# Altium schematic sheet MCU.SchDoc
size A3; Organization: Altium Limited; Address1: L3, 12a Rodborough Rd; Address2: Frenchs Forest; Address3: NSW; Address4: Australia 2086
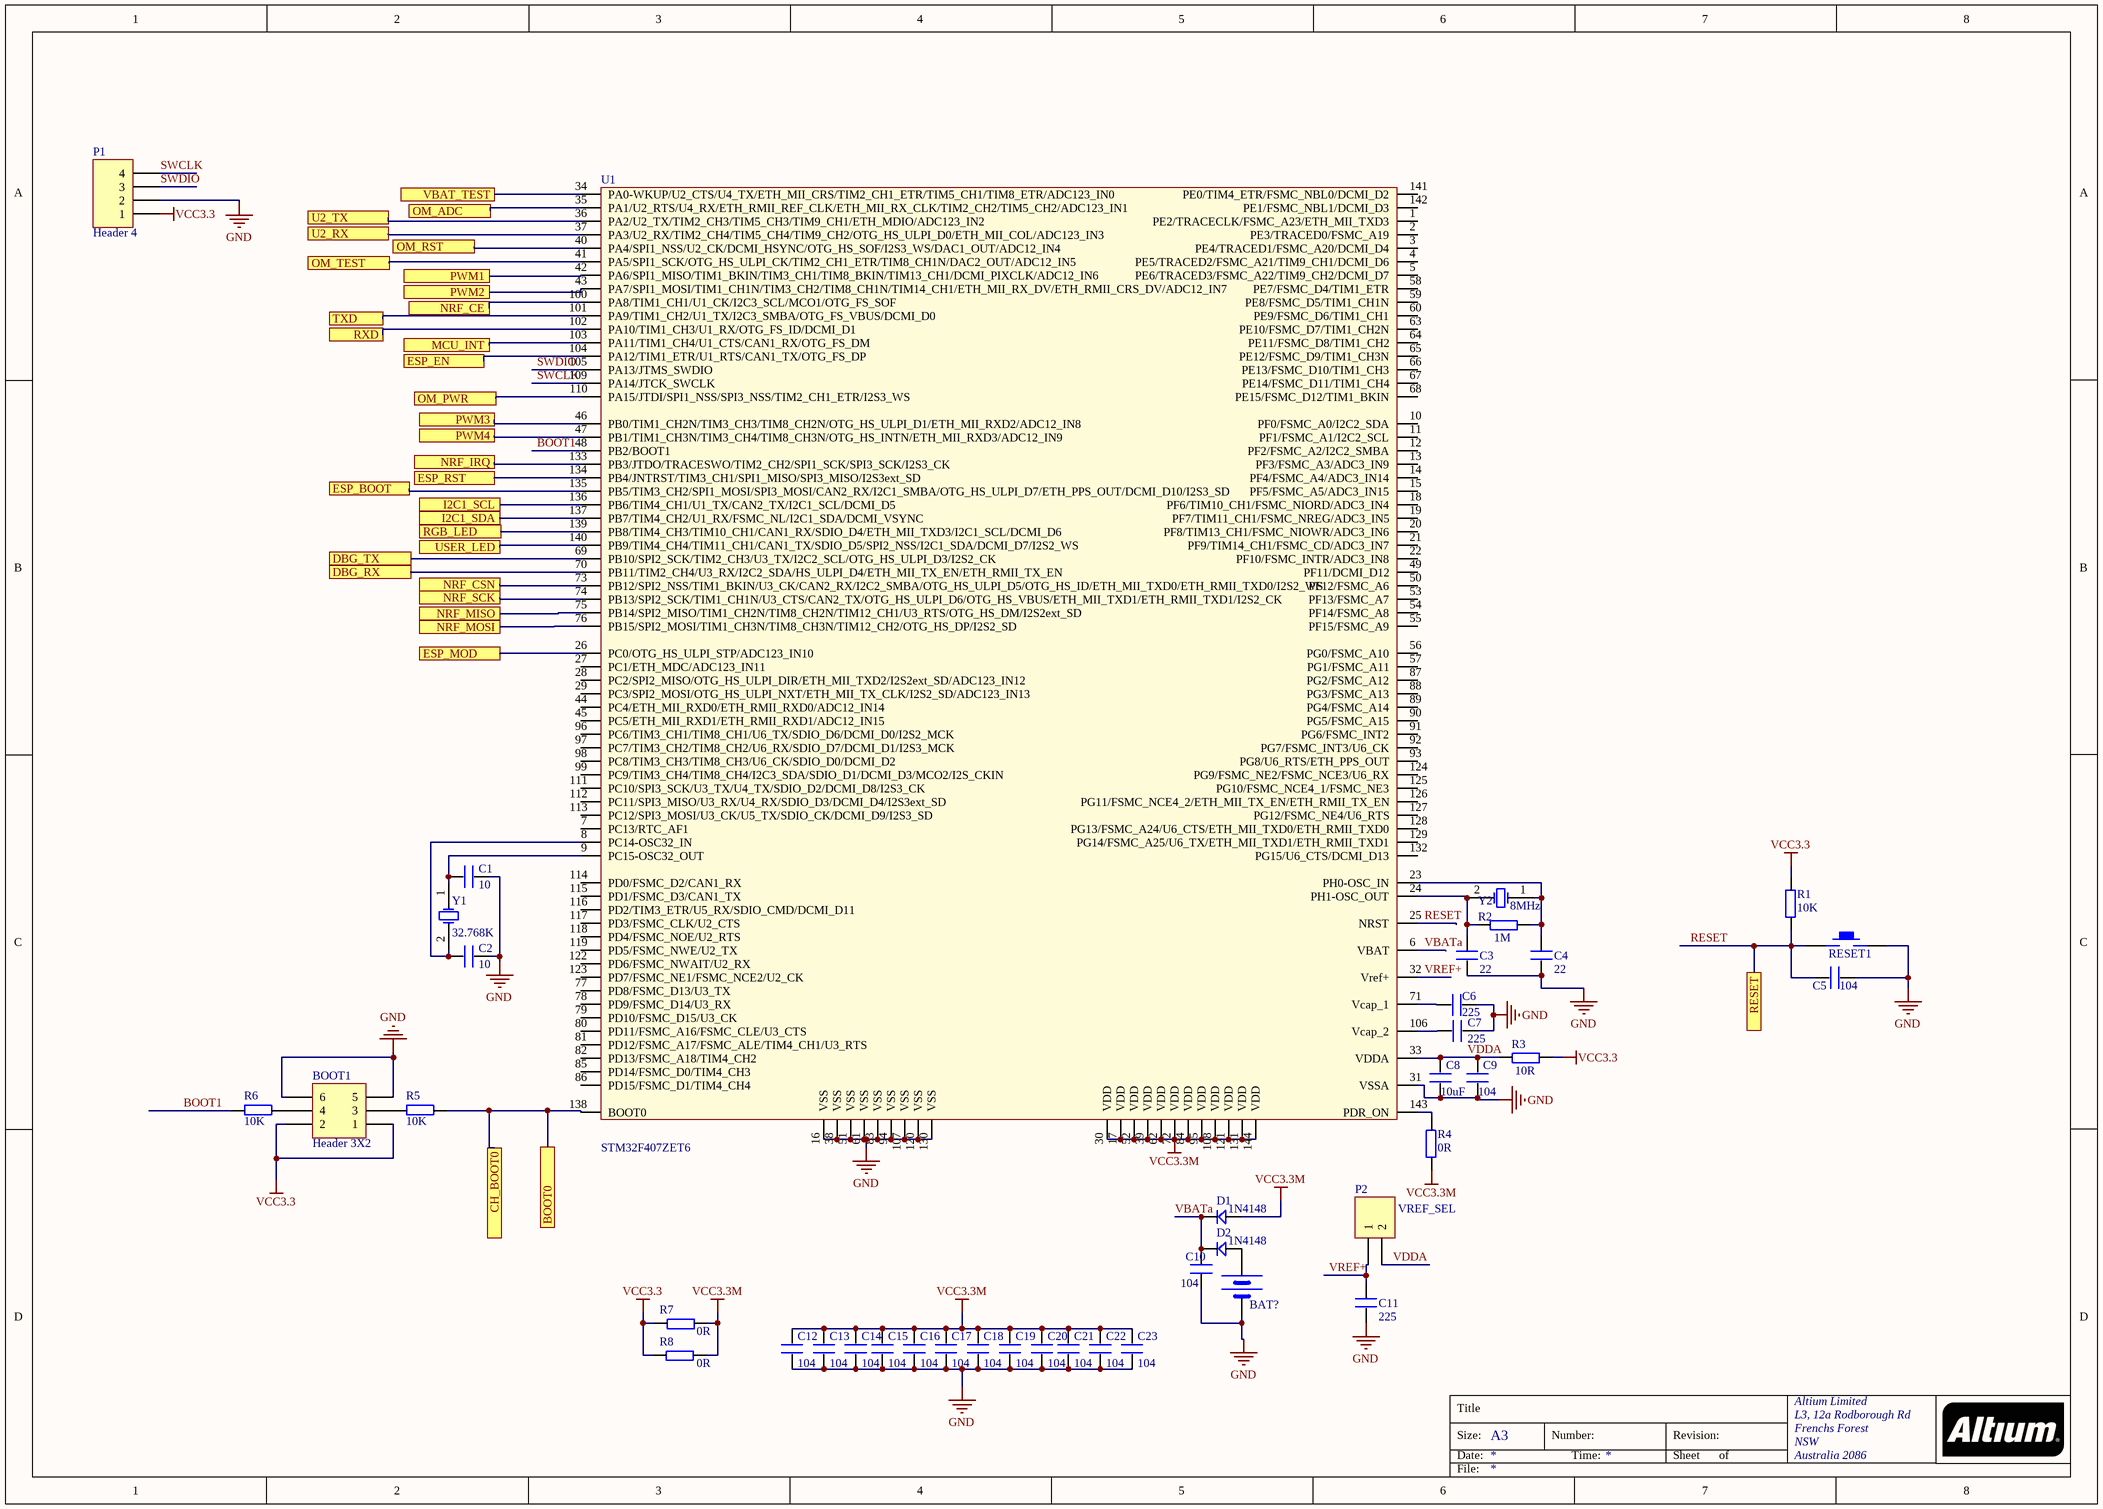
[diagram p0: MCU.SchDoc]

## Parts
BAT?  BATT  [BATM]  (value not drawn)
BOOT1  Header 3X2  [HDR2X3]
C1  10  [0603P]
C2  10  [0603P]
C3  22  [0603P]
C4  22  [0603P]
C5  104  [0603P]
C6  225  [0603P]
C7  225  [0603P]
C8  10uF  [0603P]
C9  104  [0603P]
C10  104  [0603P]
C11  225  [0603P]
C12  104  [0603P]
C13  104  [0603P]
C14  104  [0603P]
C15  104  [0603P]
C16  104  [0603P]
C17  104  [0603P]
C18  104  [0603P]
C19  104  [0603P]
C20  104  [0603P]
C21  104  [0603P]
C22  104  [0603P]
C23  104  [0603P]
D1  1N4148  [DIODE_SOP]
D2  1N4148  [DIODE_SOP]
P1  Header 4  [HDR1X4]
P2  VREF_SEL  [HDR1X2]
R1  10K  [0603P]
R2  1M  [0603P]
R3  10R  [0603P]
R4  0R  [0603P]
R5  10K  [0603P]
R6  10K  [0603P]
R7  0R  [0603P]
R8  0R  [0603P]
RESET1  KEY_M  [KEY_M]  (value not drawn)
U1  STM32F407ZET6  [LQFP144]
Y1  32.768K  [XTAL_US]
Y2  8MHz  [XTAL_US]

## Ports
BOOT0, CH_BOOT0, DBG_RX, DBG_TX, ESP_BOOT, ESP_EN, ESP_MOD, ESP_RST, I2C1_SCL, I2C1_SDA, MCU_INT, NRF_CE, NRF_CSN, NRF_IRQ, NRF_MISO, NRF_MOSI, NRF_SCK, OM_ADC, OM_PWR, OM_RST, OM_TEST, PWM1, PWM2, PWM3, PWM4, RESET, RGB_LED, RXD, TXD, U2_RX, U2_TX, USER_LED, VBAT_TEST

## Nets
GND: BAT?.2(GND) BOOT1.5 BOOT1.6 C1.1 C2.1 C3.1 C4.2 C5.2 C6.2 C7.2 C8.1 C9.2 C10.2 C11.1 C12.2 C13.2 C14.2 C15.2 C16.2 C17.2 C18.2 C19.2 C20.2 C21.2 C22.2 C23.2 P1.2 RESET1.2 U1.16(VSS) U1.31(VSSA) U1.38(VSS) U1.51(VSS) U1.61(VSS) U1.83(VSS) U1.94(VSS) U1.107(VSS) U1.120(VSS) U1.130(VSS)
VCC3.3: BOOT1.1 BOOT1.2 P1.1 R1.1 R3.2 R7.1 R8.1
VCC3.3M: C12.1 C13.1 C14.1 C15.1 C16.1 C17.1 C18.1 C19.1 C20.1 C21.1 C22.1 C23.1 D1.1 R4.2 R7.2 R8.2 U1.17(VDD) U1.30(VDD) U1.39(VDD) U1.52(VDD) U1.62(VDD) U1.72(VDD) U1.84(VDD) U1.95(VDD) U1.108(VDD) U1.121(VDD) U1.131(VDD) U1.144(VDD)
BOOT0: R5.1 U1.138(BOOT0) ; port BOOT0, port CH_BOOT0
BOOT1: R6.2 U1.48(PB2/BOOT1)
DBG_RX: U1.70(PB11/TIM2_CH4/U3_RX/I2C2_SDA/HS_ULPI_D4/ETH_MII_TX_EN/ETH_RMII_TX_EN) ; port DBG_RX
DBG_TX: U1.69(PB10/SPI2_SCK/TIM2_CH3/U3_TX/I2C2_SCL/OTG_HS_ULPI_D3/I2S2_CK) ; port DBG_TX
ESP_BOOT: U1.135(PB5/TIM3_CH2/SPI1_MOSI/SPI3_MOSI/CAN2_RX/I2C1_SMBA/OTG_HS_ULPI_D7/ETH_PPS_OUT/DCMI_D10/I2S3_SD) ; port ESP_BOOT
ESP_EN: U1.104(PA12/TIM1_ETR/U1_RTS/CAN1_TX/OTG_FS_DP) ; port ESP_EN
ESP_MOD: U1.26(PC0/OTG_HS_ULPI_STP/ADC123_IN10) ; port ESP_MOD
ESP_RST: U1.134(PB4/JNTRST/TIM3_CH1/SPI1_MISO/SPI3_MISO/I2S3ext_SD) ; port ESP_RST
I2C1_SCL: U1.136(PB6/TIM4_CH1/U1_TX/CAN2_TX/I2C1_SCL/DCMI_D5) ; port I2C1_SCL
I2C1_SDA: U1.137(PB7/TIM4_CH2/U1_RX/FSMC_NL/I2C1_SDA/DCMI_VSYNC) ; port I2C1_SDA
MCU_INT: U1.103(PA11/TIM1_CH4/U1_CTS/CAN1_RX/OTG_FS_DM) ; port MCU_INT
NRF_CE: U1.100(PA8/TIM1_CH1/U1_CK/I2C3_SCL/MCO1/OTG_FS_SOF) ; port NRF_CE
NRF_CSN: U1.73(PB12/SPI2_NSS/TIM1_BKIN/U3_CK/CAN2_RX/I2C2_SMBA/OTG_HS_ULPI_D5/OTG_HS_ID/ETH_MII_TXD0/ETH_RMII_TXD0/I2S2_WS) ; port NRF_CSN
NRF_IRQ: U1.133(PB3/JTDO/TRACESWO/TIM2_CH2/SPI1_SCK/SPI3_SCK/I2S3_CK) ; port NRF_IRQ
NRF_MISO: U1.75(PB14/SPI2_MISO/TIM1_CH2N/TIM8_CH2N/TIM12_CH1/U3_RTS/OTG_HS_DM/I2S2ext_SD) ; port NRF_MISO
NRF_MOSI: U1.76(PB15/SPI2_MOSI/TIM1_CH3N/TIM8_CH3N/TIM12_CH2/OTG_HS_DP/I2S2_SD) ; port NRF_MOSI
NRF_SCK: U1.74(PB13/SPI2_SCK/TIM1_CH1N/U3_CTS/CAN2_TX/OTG_HS_ULPI_D6/OTG_HS_VBUS/ETH_MII_TXD1/ETH_RMII_TXD1/I2S2_CK) ; port NRF_SCK
OM_ADC: U1.35(PA1/U2_RTS/U4_RX/ETH_RMII_REF_CLK/ETH_MII_RX_CLK/TIM2_CH2/TIM5_CH2/ADC123_IN1) ; port OM_ADC
OM_PWR: U1.110(PA15/JTDI/SPI1_NSS/SPI3_NSS/TIM2_CH1_ETR/I2S3_WS) ; port OM_PWR
OM_RST: U1.40(PA4/SPI1_NSS/U2_CK/DCMI_HSYNC/OTG_HS_SOF/I2S3_WS/DAC1_OUT/ADC12_IN4) ; port OM_RST
OM_TEST: U1.41(PA5/SPI1_SCK/OTG_HS_ULPI_CK/TIM2_CH1_ETR/TIM8_CH1N/DAC2_OUT/ADC12_IN5) ; port OM_TEST
PWM1: U1.42(PA6/SPI1_MISO/TIM1_BKIN/TIM3_CH1/TIM8_BKIN/TIM13_CH1/DCMI_PIXCLK/ADC12_IN6) ; port PWM1
PWM2: U1.43(PA7/SPI1_MOSI/TIM1_CH1N/TIM3_CH2/TIM8_CH1N/TIM14_CH1/ETH_MII_RX_DV/ETH_RMII_CRS_DV/ADC12_IN7) ; port PWM2
PWM3: U1.46(PB0/TIM1_CH2N/TIM3_CH3/TIM8_CH2N/OTG_HS_ULPI_D1/ETH_MII_RXD2/ADC12_IN8) ; port PWM3
PWM4: U1.47(PB1/TIM1_CH3N/TIM3_CH4/TIM8_CH3N/OTG_HS_INTN/ETH_MII_RXD3/ADC12_IN9) ; port PWM4
RESET: C5.1 R1.2 RESET1.1 U1.25(NRST) ; port RESET
RGB_LED: U1.139(PB8/TIM4_CH3/TIM10_CH1/CAN1_RX/SDIO_D4/ETH_MII_TXD3/I2C1_SCL/DCMI_D6) ; port RGB_LED
RXD: U1.102(PA10/TIM1_CH3/U1_RX/OTG_FS_ID/DCMI_D1) ; port RXD
SWCLK: P1.4 U1.109(PA14/JTCK_SWCLK)
SWDIO: P1.3 U1.105(PA13/JTMS_SWDIO)
TXD: U1.101(PA9/TIM1_CH2/U1_TX/I2C3_SMBA/OTG_FS_VBUS/DCMI_D0) ; port TXD
U2_RX: U1.37(PA3/U2_RX/TIM2_CH4/TIM5_CH4/TIM9_CH2/OTG_HS_ULPI_D0/ETH_MII_COL/ADC123_IN3) ; port U2_RX
U2_TX: U1.36(PA2/U2_TX/TIM2_CH3/TIM5_CH3/TIM9_CH1/ETH_MDIO/ADC123_IN2) ; port U2_TX
USER_LED: U1.140(PB9/TIM4_CH4/TIM11_CH1/CAN1_TX/SDIO_D5/SPI2_NSS/I2C1_SDA/DCMI_D7/I2S2_WS) ; port USER_LED
VBAT_TEST: U1.34(PA0-WKUP/U2_CTS/U4_TX/ETH_MII_CRS/TIM2_CH1_ETR/TIM5_CH1/TIM8_ETR/ADC123_IN0) ; port VBAT_TEST
VBATa: C10.1 D1.2 D2.2 U1.6(VBAT)
VDDA: C8.2 C9.1 P2.2 R3.1 U1.33(VDDA)
VREF+: C11.2 P2.1 U1.32(Vref+)
NetBAT?_1: BAT?.1(VCC) D2.1
NetBOOT1_3: BOOT1.3 R5.2
NetBOOT1_4: BOOT1.4 R6.1
NetC1_2: C1.2 U1.9(PC15-OSC32_OUT) Y1.1(OSC1)
NetC2_2: C2.2 U1.8(PC14-OSC32_IN) Y1.2(OSC2)
NetC3_2: C3.2 R2.1 U1.24(PH1-OSC_OUT) Y2.2(OSC2)
NetC4_1: C4.1 R2.2 U1.23(PH0-OSC_IN) Y2.1(OSC1)
NetC6_1: C6.1 U1.71(Vcap_1)
NetC7_1: C7.1 U1.106(Vcap_2)
NetR4_1: R4.1 U1.143(PDR_ON)

Not connected (* = marked no-connect by the designer): U1 1(PE2/TRACECLK/FSMC_A23/ETH_MII_TXD3) 2(PE3/TRACED0/FSMC_A19) 3(PE4/TRACED1/FSMC_A20/DCMI_D4) 4(PE5/TRACED2/FSMC_A21/TIM9_CH1/DCMI_D6) 5(PE6/TRACED3/FSMC_A22/TIM9_CH2/DCMI_D7) 7(PC13/RTC_AF1) 10(PF0/FSMC_A0/I2C2_SDA) 11(PF1/FSMC_A1/I2C2_SCL) 12(PF2/FSMC_A2/I2C2_SMBA) 13(PF3/FSMC_A3/ADC3_IN9) 14(PF4/FSMC_A4/ADC3_IN14) 15(PF5/FSMC_A5/ADC3_IN15) 18(PF6/TIM10_CH1/FSMC_NIORD/ADC3_IN4) 19(PF7/TIM11_CH1/FSMC_NREG/ADC3_IN5) 20(PF8/TIM13_CH1/FSMC_NIOWR/ADC3_IN6) 21(PF9/TIM14_CH1/FSMC_CD/ADC3_IN7) 22(PF10/FSMC_INTR/ADC3_IN8) 27(PC1/ETH_MDC/ADC123_IN11) 28(PC2/SPI2_MISO/OTG_HS_ULPI_DIR/ETH_MII_TXD2/I2S2ext_SD/ADC123_IN12) 29(PC3/SPI2_MOSI/OTG_HS_ULPI_NXT/ETH_MII_TX_CLK/I2S2_SD/ADC123_IN13) 44(PC4/ETH_MII_RXD0/ETH_RMII_RXD0/ADC12_IN14) 45(PC5/ETH_MII_RXD1/ETH_RMII_RXD1/ADC12_IN15) 49(PF11/DCMI_D12) 50(PF12/FSMC_A6) 53(PF13/FSMC_A7) 54(PF14/FSMC_A8) 55(PF15/FSMC_A9) 56(PG0/FSMC_A10) 57(PG1/FSMC_A11) 58(PE7/FSMC_D4/TIM1_ETR) 59(PE8/FSMC_D5/TIM1_CH1N) 60(PE9/FSMC_D6/TIM1_CH1) 63(PE10/FSMC_D7/TIM1_CH2N) 64(PE11/FSMC_D8/TIM1_CH2) 65(PE12/FSMC_D9/TIM1_CH3N) 66(PE13/FSMC_D10/TIM1_CH3) 67(PE14/FSMC_D11/TIM1_CH4) 68(PE15/FSMC_D12/TIM1_BKIN) 77(PD8/FSMC_D13/U3_TX) 78(PD9/FSMC_D14/U3_RX) 79(PD10/FSMC_D15/U3_CK) 80(PD11/FSMC_A16/FSMC_CLE/U3_CTS) 81(PD12/FSMC_A17/FSMC_ALE/TIM4_CH1/U3_RTS) 82(PD13/FSMC_A18/TIM4_CH2) 85(PD14/FSMC_D0/TIM4_CH3) 86(PD15/FSMC_D1/TIM4_CH4) 87(PG2/FSMC_A12) 88(PG3/FSMC_A13) 89(PG4/FSMC_A14) 90(PG5/FSMC_A15) 91(PG6/FSMC_INT2) 92(PG7/FSMC_INT3/U6_CK) 93(PG8/U6_RTS/ETH_PPS_OUT) 96(PC6/TIM3_CH1/TIM8_CH1/U6_TX/SDIO_D6/DCMI_D0/I2S2_MCK) 97(PC7/TIM3_CH2/TIM8_CH2/U6_RX/SDIO_D7/DCMI_D1/I2S3_MCK) 98(PC8/TIM3_CH3/TIM8_CH3/U6_CK/SDIO_D0/DCMI_D2) 99(PC9/TIM3_CH4/TIM8_CH4/I2C3_SDA/SDIO_D1/DCMI_D3/MCO2/I2S_CKIN) 111(PC10/SPI3_SCK/U3_TX/U4_TX/SDIO_D2/DCMI_D8/I2S3_CK) 112(PC11/SPI3_MISO/U3_RX/U4_RX/SDIO_D3/DCMI_D4/I2S3ext_SD) 113(PC12/SPI3_MOSI/U3_CK/U5_TX/SDIO_CK/DCMI_D9/I2S3_SD) 114(PD0/FSMC_D2/CAN1_RX) 115(PD1/FSMC_D3/CAN1_TX) 116(PD2/TIM3_ETR/U5_RX/SDIO_CMD/DCMI_D11) 117(PD3/FSMC_CLK/U2_CTS) 118(PD4/FSMC_NOE/U2_RTS) 119(PD5/FSMC_NWE/U2_TX) 122(PD6/FSMC_NWAIT/U2_RX) 123(PD7/FSMC_NE1/FSMC_NCE2/U2_CK) 124(PG9/FSMC_NE2/FSMC_NCE3/U6_RX) 125(PG10/FSMC_NCE4_1/FSMC_NE3) 126(PG11/FSMC_NCE4_2/ETH_MII_TX_EN/ETH_RMII_TX_EN) 127(PG12/FSMC_NE4/U6_RTS) 128(PG13/FSMC_A24/U6_CTS/ETH_MII_TXD0/ETH_RMII_TXD0) 129(PG14/FSMC_A25/U6_TX/ETH_MII_TXD1/ETH_RMII_TXD1) 132(PG15/U6_CTS/DCMI_D13) 141(PE0/TIM4_ETR/FSMC_NBL0/DCMI_D2) 142(PE1/FSMC_NBL1/DCMI_D3)

## Notes on the sheet
- Title
- Size:
- Date:
- A3
- Number:
- Time:
- Revision:
- Sheet
- of
- File:

## Library data of the parts
BAT? = BAT
BOOT1 = Header 3X2: Header, 3-Pin, Dual row; LatestRevisionDate: 17-Jul-2002; LatestRevisionNote: Re-released for DXP Platform.; Publisher: Altium Limited
C1-C23 = C
D1 D2 = D
P1 = Header 4: Header, 4-Pin; LatestRevisionDate: 17-Jul-2002; LatestRevisionNote: Re-released for DXP Platform.; Publisher: Altium Limited
P2 = Header 2: Header, 2-Pin; LatestRevisionDate: 17-Jul-2002; LatestRevisionNote: Re-released for DXP Platform.; Publisher: Altium Limited
R1-R8 = R
Y1 Y2 = XTAL: Crystal Oscillator; Published: 8-Jun-2000; LatestRevisionDate: 17-Jul-2002; LatestRevisionNote: Re-released for DXP Platform.; Publisher: Altium Limited